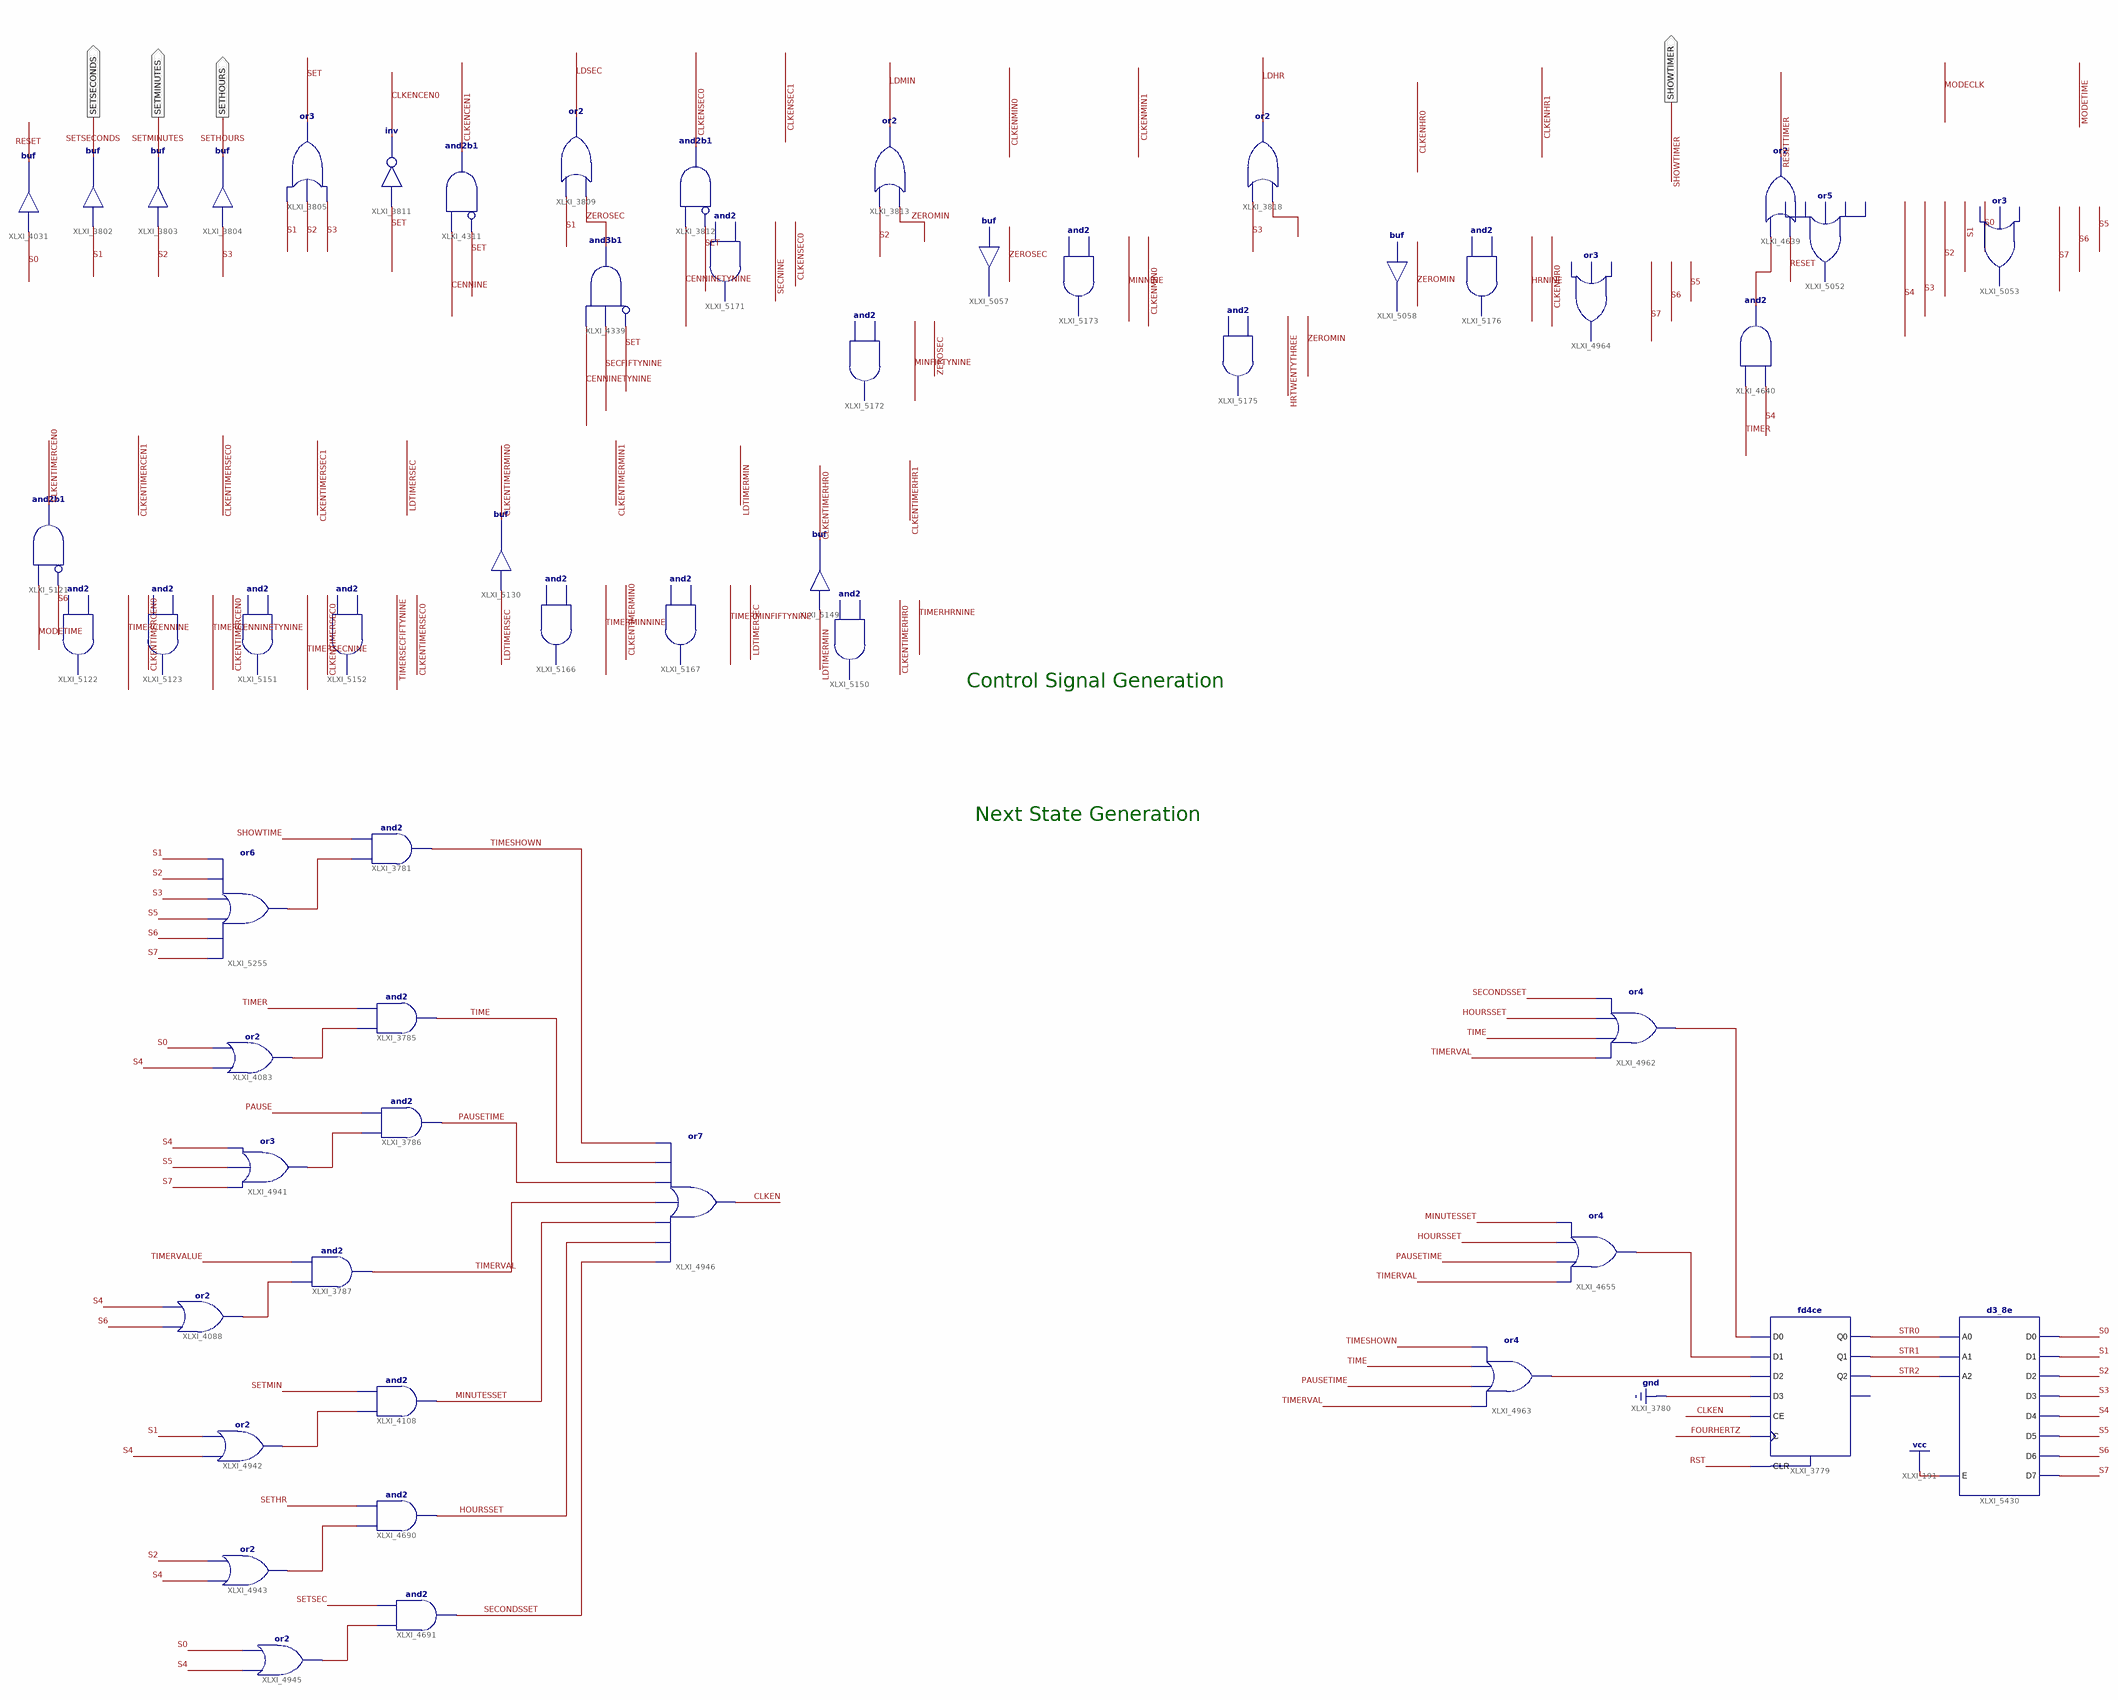
[diagram p0: schematic sheet 1]
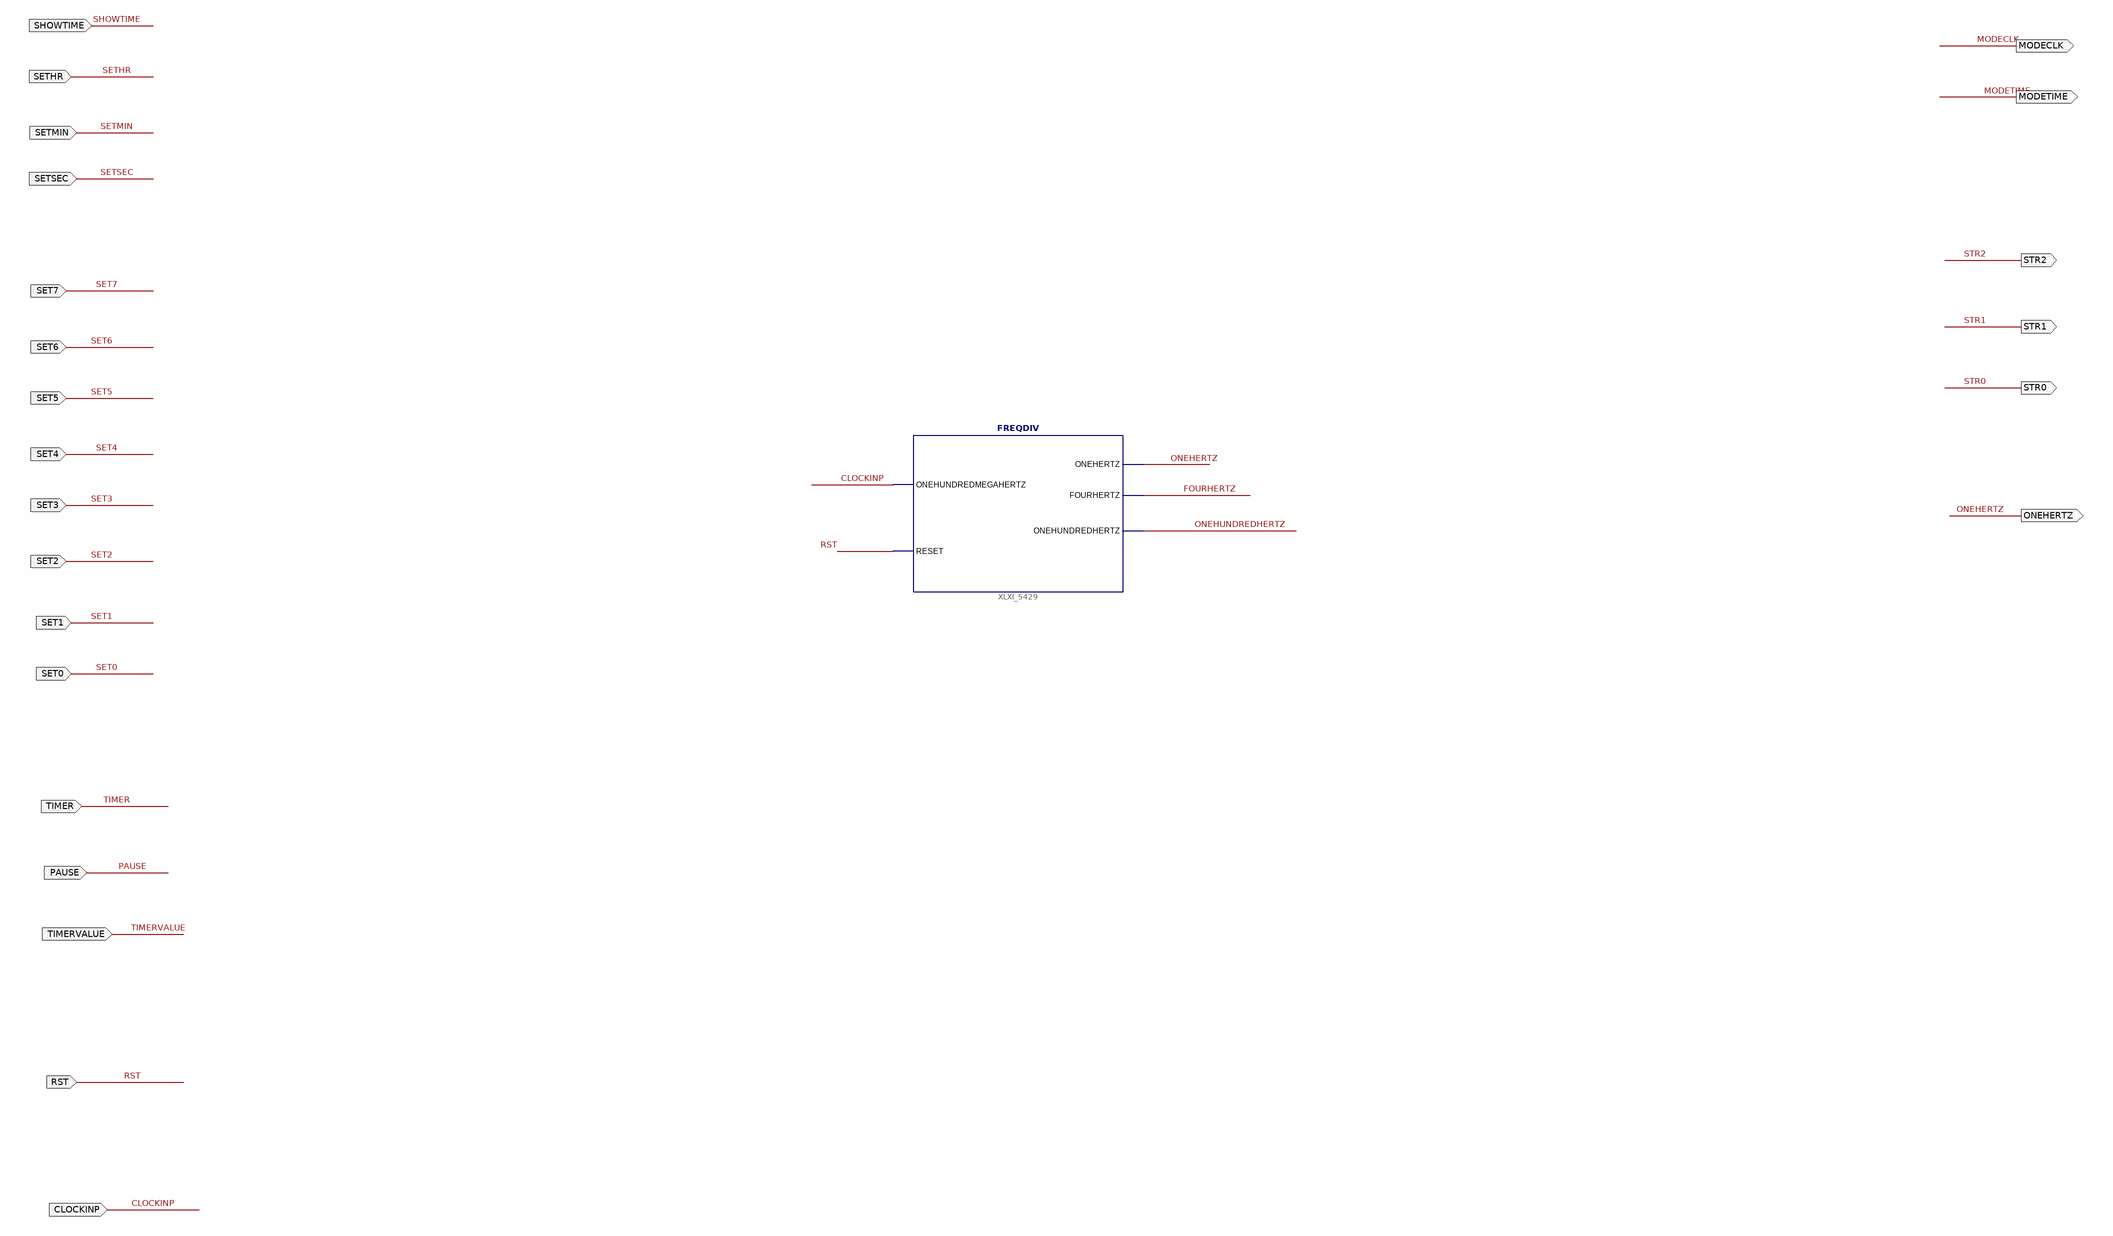
[diagram p1: schematic sheet 2]
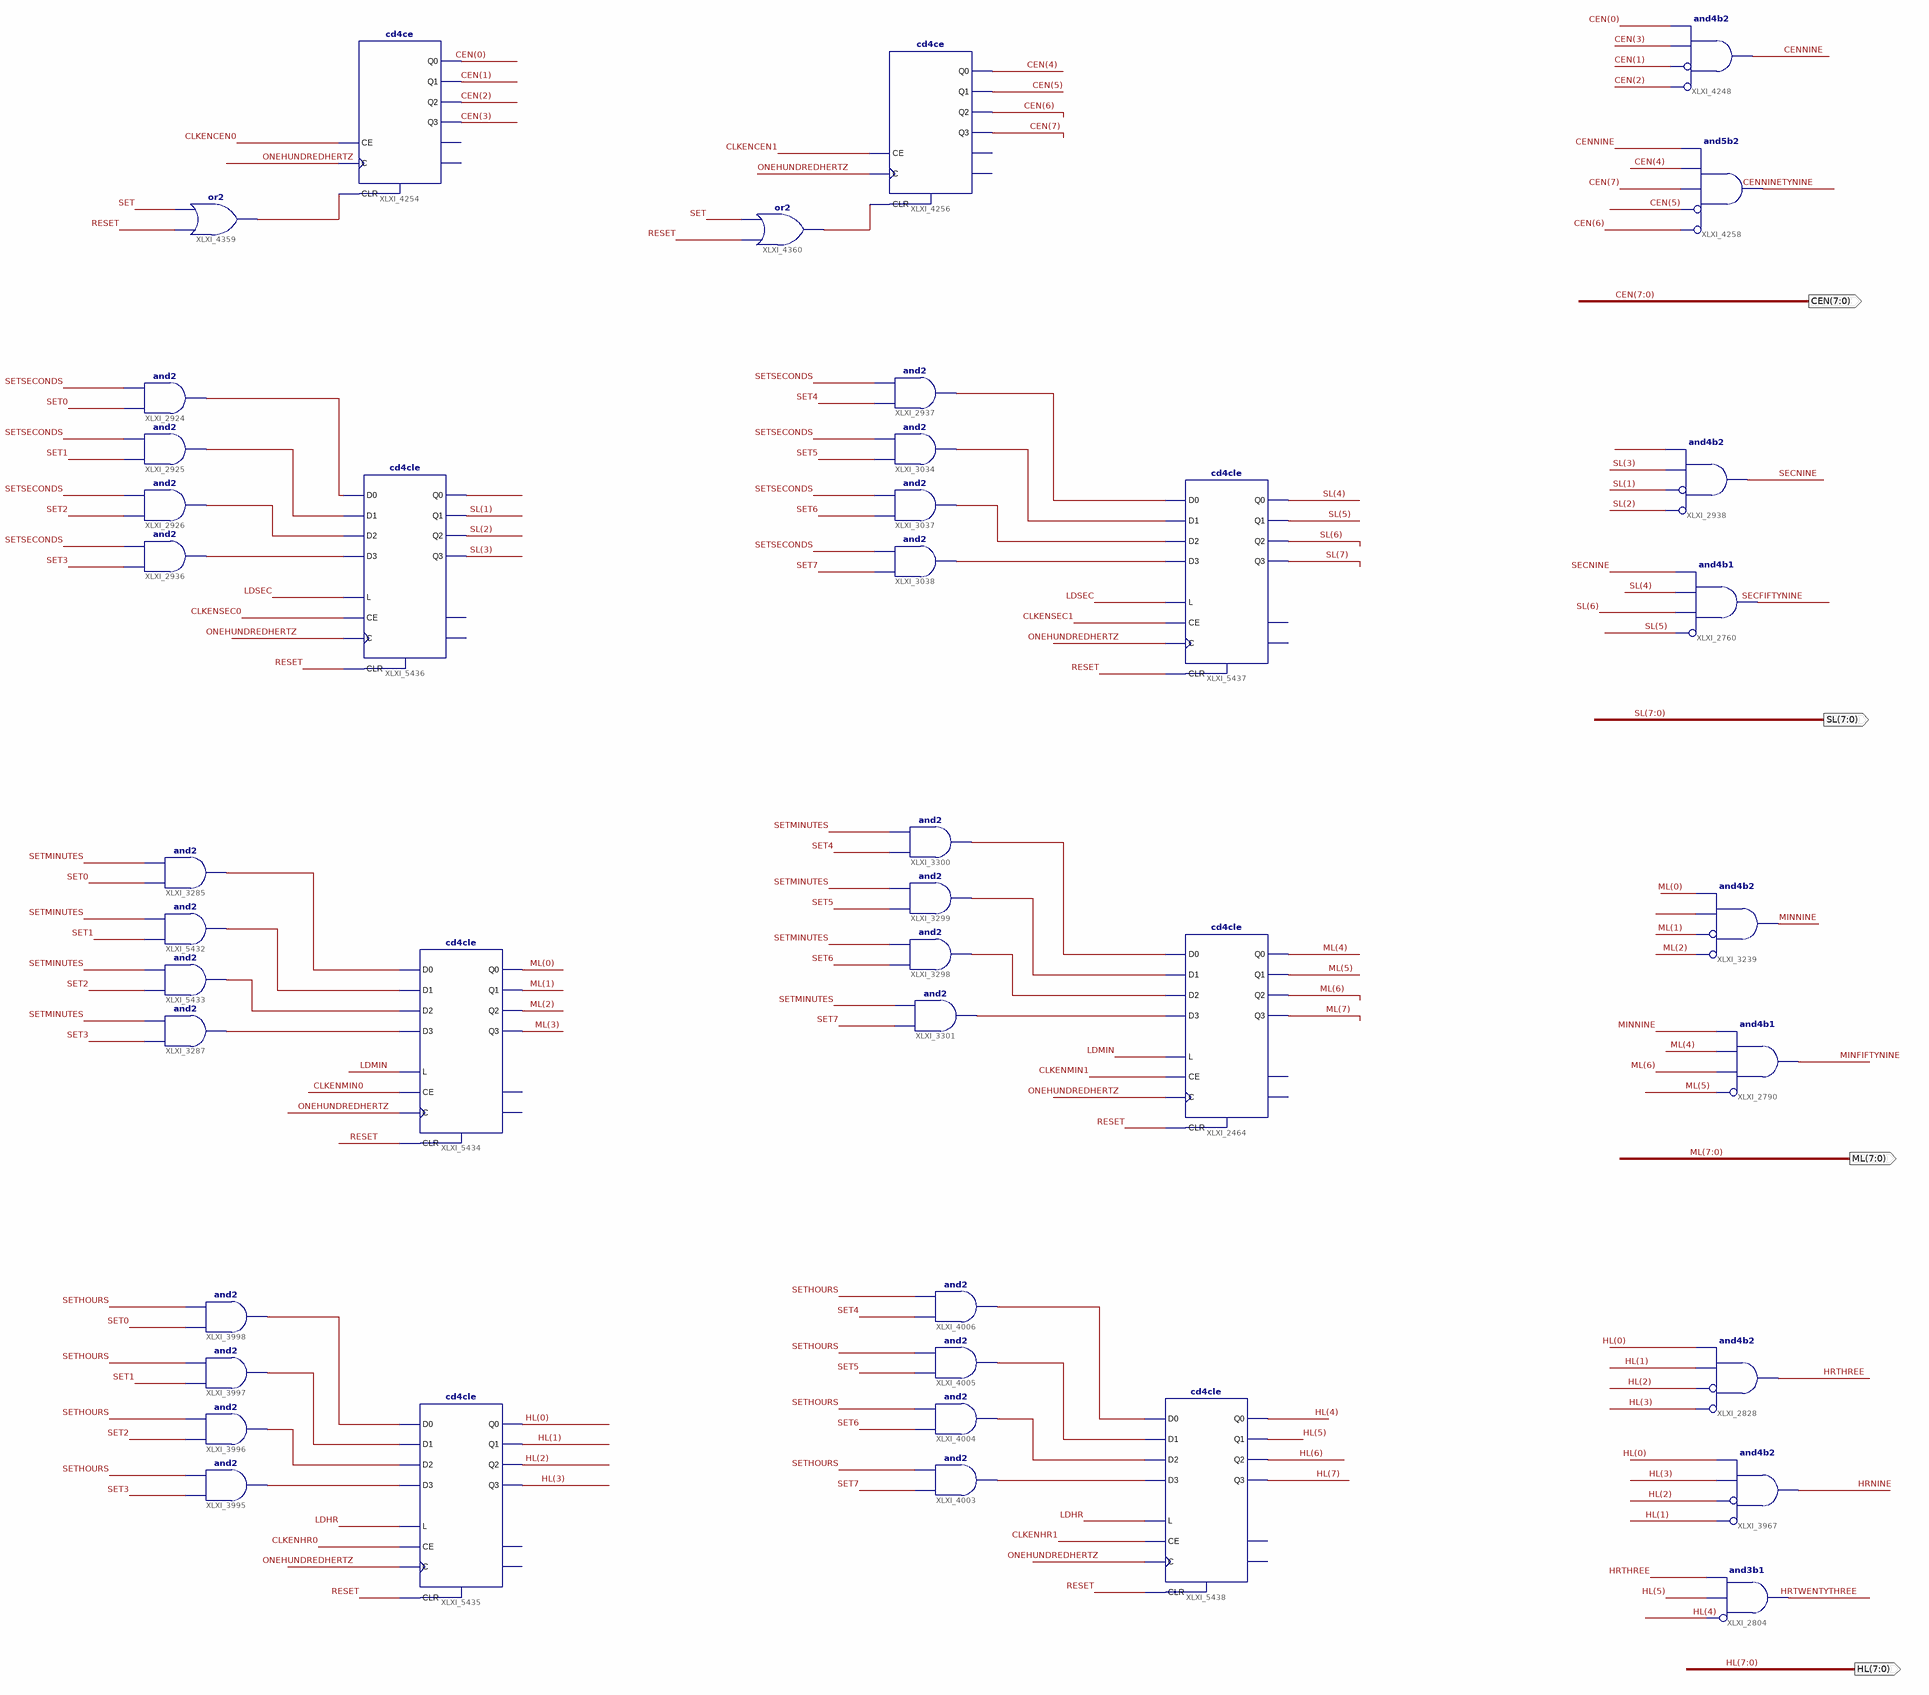
[diagram p2: schematic sheet 3]
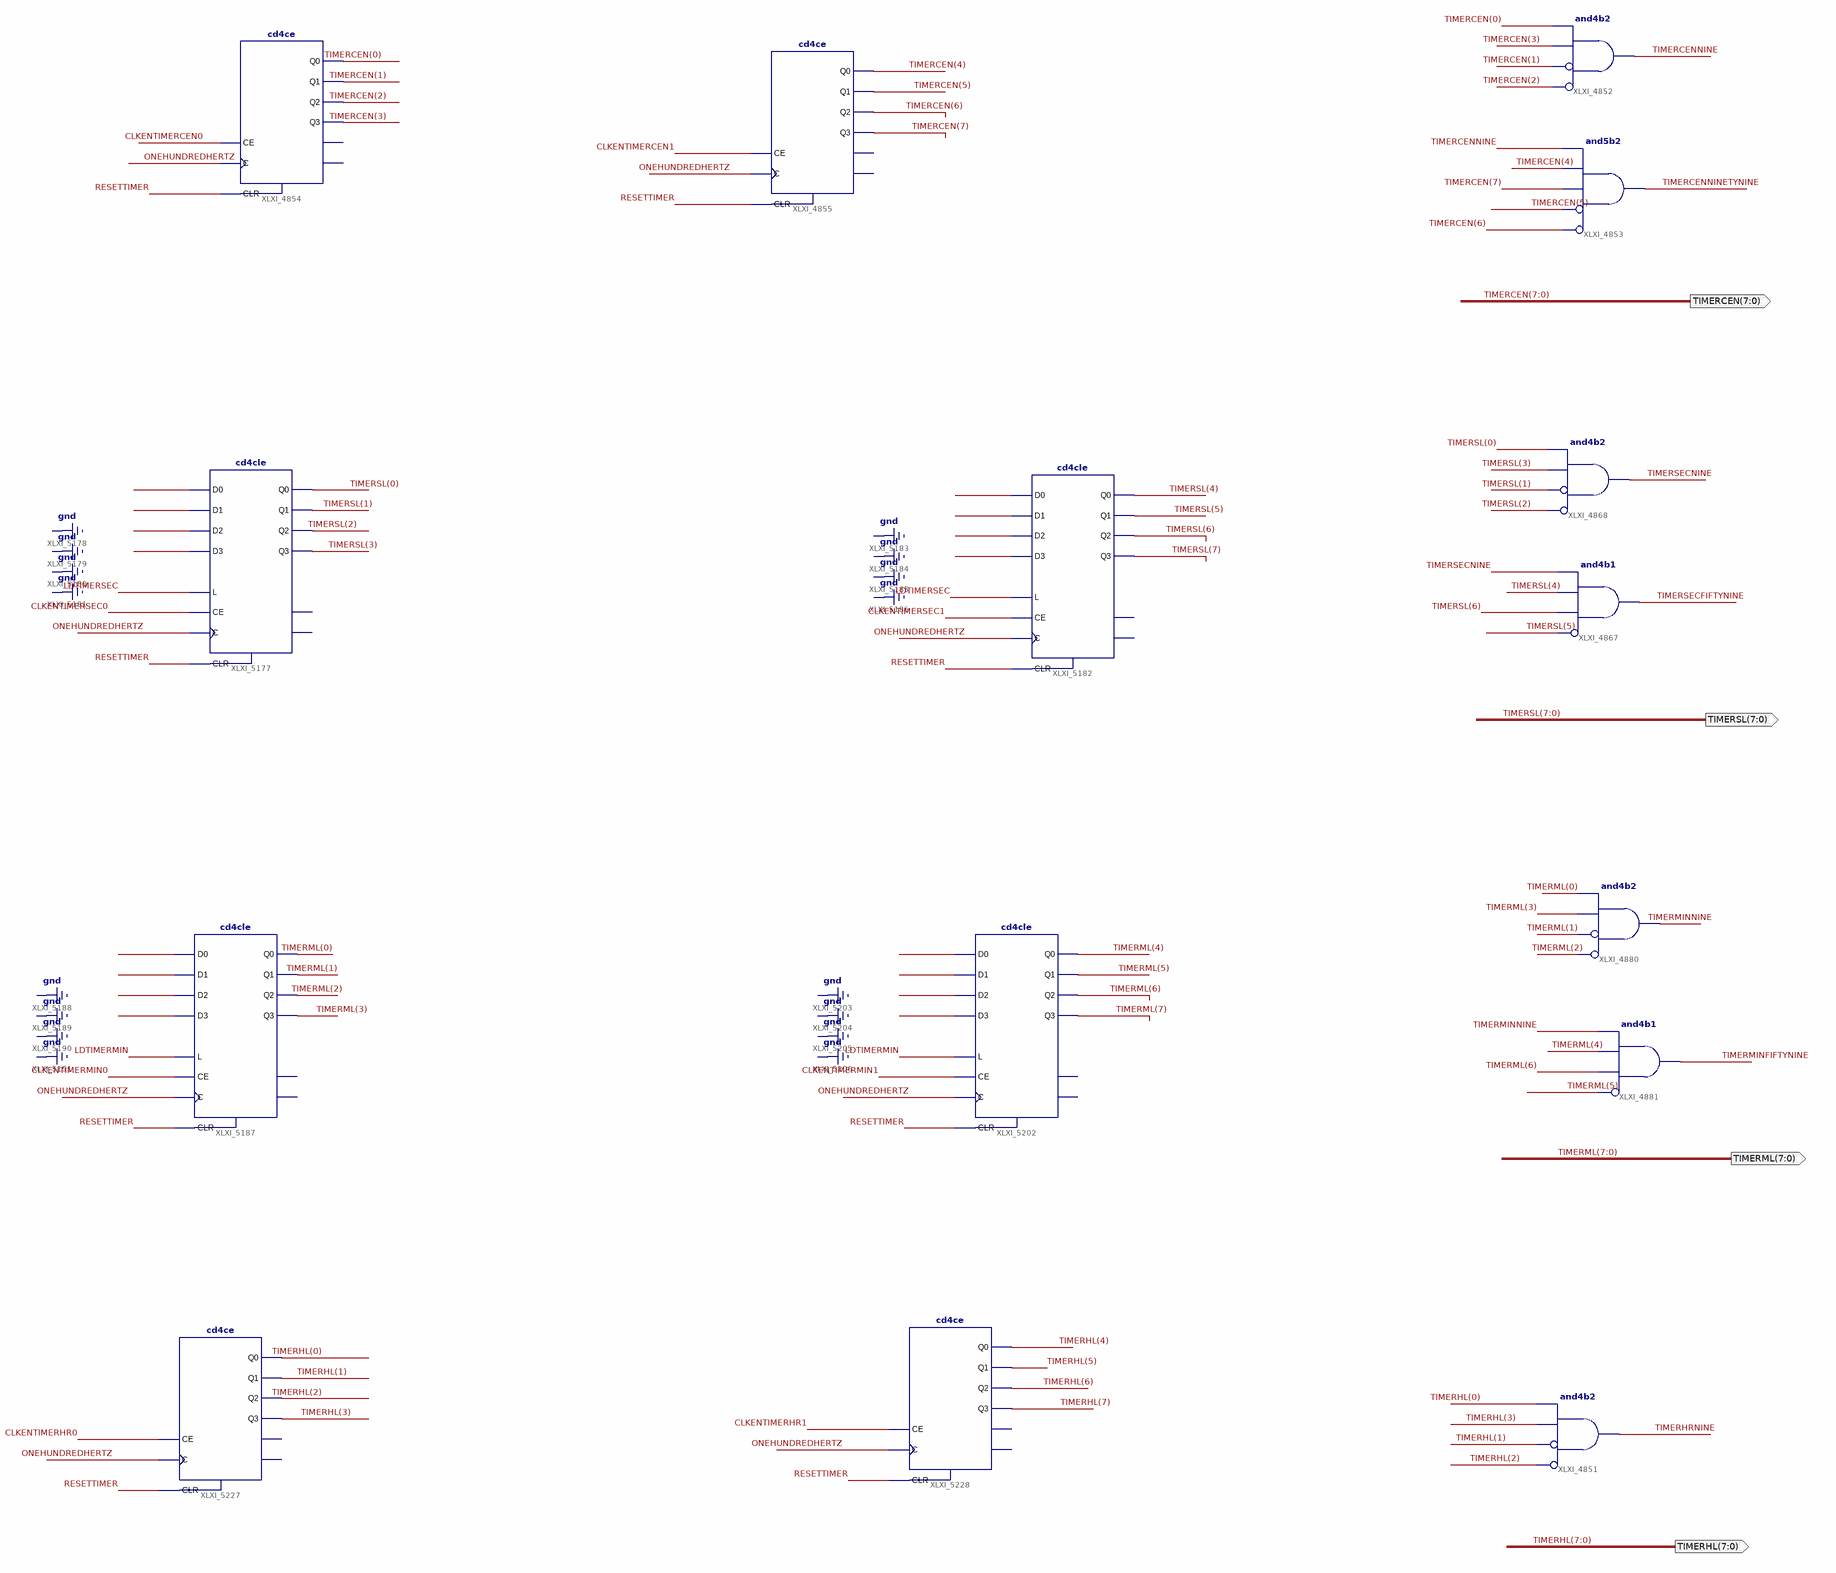
[diagram p3: schematic sheet 4]
// Xilinx ISE schematic clockblock.sch (artix7) as structural Verilog: 113 symbols, 35 ports
module clockblock (
  input  SET0,
  input  SET1,
  input  SET2,
  input  SET3,
  input  SET4,
  input  SET5,
  input  SET6,
  input  SET7,
  input  SETHR,
  input  SETMIN,
  input  SETSEC,
  input  SHOWTIME,
  input  RST,
  input  TIMER,
  input  PAUSE,
  input  TIMERVALUE,
  input  CLOCKINP,
  output ONEHERTZ,
  output SETMINUTES,
  output SETHOURS,
  output SETSECONDS,
  output [7:0] CEN,
  output [7:0] SL,
  output [7:0] ML,
  output [7:0] HL,
  output SHOWTIMER,
  output [7:0] TIMERCEN,
  output [7:0] TIMERSL,
  output [7:0] TIMERML,
  output MODECLK,
  output MODETIME,
  output [7:0] TIMERHL,
  output STR2,
  output STR1,
  output STR0
);

  wire CENNINE, CENNINETYNINE, CLKEN, CLKENCEN0, CLKENCEN1, CLKENHR0, CLKENHR1, CLKENMIN0, CLKENMIN1,
       CLKENSEC0, CLKENSEC1, CLKENTIMERCEN0, CLKENTIMERCEN1, CLKENTIMERHR0, CLKENTIMERHR1, CLKENTIMERMIN0,
       CLKENTIMERMIN1, CLKENTIMERSEC0, CLKENTIMERSEC1, FOURHERTZ, HOURSSET, HRNINE, HRTHREE, HRTWENTYTHREE,
       LDHR, LDMIN, LDSEC, LDTIMERMIN, LDTIMERSEC, MINFIFTYNINE, MINNINE, MINUTESSET, ONEHUNDREDHERTZ,
       PAUSETIME, RESET, RESETTIMER, S0, S1, S2, S3, S4, S5, S6, S7, SECFIFTYNINE, SECNINE, SECONDSSET, SET,
       TIME, TIMERCENNINE, TIMERCENNINETYNINE, TIMERHRNINE, TIMERMINFIFTYNINE, TIMERMINNINE,
       TIMERSECFIFTYNINE, TIMERSECNINE, TIMERVAL, TIMESHOWN, XLXN_13329, XLXN_13330, XLXN_13331, XLXN_13332,
       XLXN_13353, XLXN_13354, XLXN_13355, XLXN_13356, XLXN_13446, XLXN_13447, XLXN_13450, XLXN_13451,
       XLXN_13600, XLXN_13601, XLXN_13602, XLXN_13669, XLXN_13671, XLXN_13672, XLXN_14325, XLXN_15410,
       XLXN_17314, XLXN_17406, XLXN_18079, XLXN_18080, XLXN_18102, XLXN_18105, XLXN_18201, XLXN_18385,
       XLXN_19485, XLXN_19489, XLXN_20635, XLXN_20683, XLXN_21780, XLXN_21821, XLXN_21833, XLXN_21851,
       XLXN_21870, XLXN_21876, ZEROMIN, ZEROSEC;

  and XLXI_3967 (HRNINE, ~HL[1], ~HL[2], HL[3], HL[0]);  // and4b2
  and XLXI_2828 (HRTHREE, ~HL[3], ~HL[2], HL[1], HL[0]);  // and4b2
  and XLXI_4248 (CENNINE, ~CEN[2], ~CEN[1], CEN[3], CEN[0]);  // and4b2
  and XLXI_4258 (CENNINETYNINE, ~CEN[6], ~CEN[5], CEN[7], CEN[4], CENNINE);  // and5b2
  cd4ce XLXI_4254 (
    .C(ONEHUNDREDHERTZ), .CE(CLKENCEN0), .CLR(XLXN_19489), .Q0(CEN[0]), .Q1(CEN[1]), .Q2(CEN[2]), .Q3(CEN[3]));  // open: CEO, TC
  cd4ce XLXI_4256 (
    .C(ONEHUNDREDHERTZ), .CE(CLKENCEN1), .CLR(XLXN_19485), .Q0(CEN[4]), .Q1(CEN[5]), .Q2(CEN[6]), .Q3(CEN[7]));  // open: CEO, TC
  or XLXI_4359 (XLXN_19489, RESET, SET);
  or XLXI_4360 (XLXN_19485, RESET, SET);
  and XLXI_2760 (SECFIFTYNINE, ~SL[5], SL[6], SL[4], SECNINE);  // and4b1
  and XLXI_2938 (SECNINE, ~SL[2], ~SL[1], SL[3], SL[0]);  // and4b2
  and XLXI_3239 (MINNINE, ~ML[2], ~ML[1], ML[3], ML[0]);  // and4b2
  and XLXI_2790 (MINFIFTYNINE, ~ML[5], ML[6], ML[4], MINNINE);  // and4b1
  fd4ce XLXI_3779 (
    .C(FOURHERTZ), .CE(CLKEN), .CLR(RST), .D0(XLXN_18201), .D1(XLXN_17314), .D2(XLXN_20683), .D3(1'b0),
    .Q0(STR0), .Q1(STR1), .Q2(STR2));  // open: Q3
  and XLXI_2804 (HRTWENTYTHREE, ~HL[4], HL[5], HRTHREE);  // and3b1
  or XLXI_4655 (XLXN_17314, TIMERVAL, PAUSETIME, HOURSSET, MINUTESSET);
  and XLXI_4852 (TIMERCENNINE, ~TIMERCEN[2], ~TIMERCEN[1], TIMERCEN[3], TIMERCEN[0]);  // and4b2
  and XLXI_4853 (TIMERCENNINETYNINE, ~TIMERCEN[6], ~TIMERCEN[5], TIMERCEN[7], TIMERCEN[4], TIMERCENNINE);  // and5b2
  cd4ce XLXI_4854 (
    .C(ONEHUNDREDHERTZ), .CE(CLKENTIMERCEN0), .CLR(RESETTIMER), .Q0(TIMERCEN[0]), .Q1(TIMERCEN[1]),
    .Q2(TIMERCEN[2]), .Q3(TIMERCEN[3]));  // open: CEO, TC
  cd4ce XLXI_4855 (
    .C(ONEHUNDREDHERTZ), .CE(CLKENTIMERCEN1), .CLR(RESETTIMER), .Q0(TIMERCEN[4]), .Q1(TIMERCEN[5]),
    .Q2(TIMERCEN[6]), .Q3(TIMERCEN[7]));  // open: CEO, TC
  and XLXI_4867 (TIMERSECFIFTYNINE, ~TIMERSL[5], TIMERSL[6], TIMERSL[4], TIMERSECNINE);  // and4b1
  and XLXI_4868 (TIMERSECNINE, ~TIMERSL[2], ~TIMERSL[1], TIMERSL[3], TIMERSL[0]);  // and4b2
  and XLXI_4880 (TIMERMINNINE, ~TIMERML[2], ~TIMERML[1], TIMERML[3], TIMERML[0]);  // and4b2
  and XLXI_4881 (TIMERMINFIFTYNINE, ~TIMERML[5], TIMERML[6], TIMERML[4], TIMERMINNINE);  // and4b1
  or XLXI_4962 (XLXN_18201, TIMERVAL, TIME, HOURSSET, SECONDSSET);
  or XLXI_4963 (XLXN_20683, TIMERVAL, PAUSETIME, TIME, TIMESHOWN);
  and XLXI_3787 (TIMERVAL, XLXN_21851, TIMERVALUE);
  or XLXI_4088 (XLXN_21851, S6, S4);
  and XLXI_3786 (PAUSETIME, XLXN_21833, PAUSE);
  or XLXI_4941 (XLXN_21833, S4, S5, S7);
  and XLXI_3785 (TIME, XLXN_21821, TIMER);
  or XLXI_4083 (XLXN_21821, S4, S0);
  and XLXI_4691 (SECONDSSET, XLXN_21876, SETSEC);
  or XLXI_4945 (XLXN_21876, S0, S4);
  or XLXI_4946 (CLKEN, TIMESHOWN, TIME, PAUSETIME, TIMERVAL, MINUTESSET, HOURSSET, SECONDSSET);
  or XLXI_4942 (XLXN_18385, S1, S4);
  and XLXI_4108 (MINUTESSET, XLXN_18385, SETMIN);
  and XLXI_4690 (HOURSSET, XLXN_21870, SETHR);
  or XLXI_4943 (XLXN_21870, S2, S4);
  or XLXI_3805 (SET, S3, S2, S1);
  not XLXI_3811 (CLKENCEN0, SET);
  and XLXI_4311 (CLKENCEN1, ~SET, CENNINE);  // and2b1
  or XLXI_3809 (LDSEC, ZEROSEC, S1);
  and XLXI_4339 (ZEROSEC, ~SET, SECFIFTYNINE, CENNINETYNINE);  // and3b1
  and XLXI_3812 (CLKENSEC0, ~SET, CENNINETYNINE);  // and2b1
  or XLXI_3813 (LDMIN, ZEROMIN, S2);
  buf XLXI_5057 (CLKENMIN0, ZEROSEC);
  or XLXI_3818 (LDHR, XLXN_17406, S3);
  buf XLXI_5058 (CLKENHR0, ZEROMIN);
  or XLXI_4639 (RESETTIMER, RESET, XLXN_20635);
  and XLXI_4640 (XLXN_20635, S4, TIMER);
  or XLXI_5053 (MODETIME, S7, S6, S5);
  or XLXI_5052 (MODECLK, S4, S3, S2, S1, S0);
  and XLXI_5121 (CLKENTIMERCEN0, ~S6, MODETIME);  // and2b1
  and XLXI_5122 (CLKENTIMERCEN1, TIMERCENNINE, CLKENTIMERCEN0);
  and XLXI_5123 (CLKENTIMERSEC0, TIMERCENNINETYNINE, CLKENTIMERCEN0);
  and XLXI_5151 (CLKENTIMERSEC1, TIMERSECNINE, CLKENTIMERSEC0);
  and XLXI_5152 (LDTIMERSEC, TIMERSECFIFTYNINE, CLKENTIMERSEC0);
  buf XLXI_5130 (CLKENTIMERMIN0, LDTIMERSEC);
  and XLXI_5166 (CLKENTIMERMIN1, TIMERMINNINE, CLKENTIMERMIN0);
  and XLXI_5167 (LDTIMERMIN, TIMERMINFIFTYNINE, LDTIMERSEC);
  buf XLXI_5149 (CLKENTIMERHR0, LDTIMERMIN);
  and XLXI_5150 (CLKENTIMERHR1, CLKENTIMERHR0, TIMERHRNINE);
  and XLXI_5171 (CLKENSEC1, SECNINE, CLKENSEC0);
  and XLXI_5172 (ZEROMIN, MINFIFTYNINE, ZEROSEC);
  and XLXI_5173 (CLKENMIN1, MINNINE, CLKENMIN0);
  and XLXI_5175 (XLXN_17406, HRTWENTYTHREE, ZEROMIN);
  and XLXI_5176 (CLKENHR1, HRNINE, CLKENHR0);
  cd4cle XLXI_5177 (
    .C(ONEHUNDREDHERTZ), .CE(CLKENTIMERSEC0), .CLR(RESETTIMER), .D0(1'b0), .D1(1'b0), .D2(1'b0), .D3(1'b0),
    .L(LDTIMERSEC), .Q0(TIMERSL[0]), .Q1(TIMERSL[1]), .Q2(TIMERSL[2]), .Q3(TIMERSL[3]));  // open: CEO, TC
  cd4cle XLXI_5182 (
    .C(ONEHUNDREDHERTZ), .CE(CLKENTIMERSEC1), .CLR(RESETTIMER), .D0(1'b0), .D1(1'b0), .D2(1'b0), .D3(1'b0),
    .L(LDTIMERSEC), .Q0(TIMERSL[4]), .Q1(TIMERSL[5]), .Q2(TIMERSL[6]), .Q3(TIMERSL[7]));  // open: CEO, TC
  cd4cle XLXI_5187 (
    .C(ONEHUNDREDHERTZ), .CE(CLKENTIMERMIN0), .CLR(RESETTIMER), .D0(1'b0), .D1(1'b0), .D2(1'b0), .D3(1'b0),
    .L(LDTIMERMIN), .Q0(TIMERML[0]), .Q1(TIMERML[1]), .Q2(TIMERML[2]), .Q3(TIMERML[3]));  // open: CEO, TC
  cd4cle XLXI_5202 (
    .C(ONEHUNDREDHERTZ), .CE(CLKENTIMERMIN1), .CLR(RESETTIMER), .D0(1'b0), .D1(1'b0), .D2(1'b0), .D3(1'b0),
    .L(LDTIMERMIN), .Q0(TIMERML[4]), .Q1(TIMERML[5]), .Q2(TIMERML[6]), .Q3(TIMERML[7]));  // open: CEO, TC
  and XLXI_4851 (TIMERHRNINE, ~TIMERHL[2], ~TIMERHL[1], TIMERHL[3], TIMERHL[0]);  // and4b2
  cd4ce XLXI_5228 (
    .C(ONEHUNDREDHERTZ), .CE(CLKENTIMERHR1), .CLR(RESETTIMER), .Q0(TIMERHL[4]), .Q1(TIMERHL[5]),
    .Q2(TIMERHL[6]), .Q3(TIMERHL[7]));  // open: CEO, TC
  cd4ce XLXI_5227 (
    .C(ONEHUNDREDHERTZ), .CE(CLKENTIMERHR0), .CLR(RESETTIMER), .Q0(TIMERHL[0]), .Q1(TIMERHL[1]),
    .Q2(TIMERHL[2]), .Q3(TIMERHL[3]));  // open: CEO, TC
  and XLXI_3781 (TIMESHOWN, XLXN_21780, SHOWTIME);
  or XLXI_5255 (XLXN_21780, S1, S2, S3, S5, S6, S7);
  d3_8e XLXI_5430 (
    .A0(STR0), .A1(STR1), .A2(STR2), .E(1'b1), .D0(S0), .D1(S1), .D2(S2), .D3(S3), .D4(S4), .D5(S5), .D6(S6),
    .D7(S7));
  buf XLXI_4031 (RESET, S0);
  buf XLXI_3802 (SETSECONDS, S1);
  buf XLXI_3803 (SETMINUTES, S2);
  buf XLXI_3804 (SETHOURS, S3);
  or XLXI_4964 (SHOWTIMER, S7, S6, S5);
  FREQDIV XLXI_5429 (
    .ONEHUNDREDMEGAHERTZ(CLOCKINP), .RESET(RST), .ONEHERTZ(ONEHERTZ), .ONEHUNDREDHERTZ(ONEHUNDREDHERTZ),
    .FOURHERTZ(FOURHERTZ));
  and XLXI_3995 (XLXN_13446, SET3, SETHOURS);
  and XLXI_3996 (XLXN_18079, SET2, SETHOURS);
  and XLXI_3997 (XLXN_18080, SET1, SETHOURS);
  and XLXI_3998 (XLXN_13451, SET0, SETHOURS);
  and XLXI_4003 (XLXN_13450, SET7, SETHOURS);
  and XLXI_4004 (XLXN_18102, SET6, SETHOURS);
  and XLXI_4005 (XLXN_18105, SET5, SETHOURS);
  and XLXI_4006 (XLXN_13447, SET4, SETHOURS);
  and XLXI_2936 (XLXN_14325, SET3, SETSECONDS);
  and XLXI_2926 (XLXN_13602, SET2, SETSECONDS);
  and XLXI_2925 (XLXN_13601, SET1, SETSECONDS);
  and XLXI_2924 (XLXN_13600, SET0, SETSECONDS);
  and XLXI_3038 (XLXN_13332, SET7, SETSECONDS);
  and XLXI_3037 (XLXN_13331, SET6, SETSECONDS);
  and XLXI_3034 (XLXN_13330, SET5, SETSECONDS);
  and XLXI_2937 (XLXN_13329, SET4, SETSECONDS);
  and XLXI_3287 (XLXN_13669, SET3, SETMINUTES);
  and XLXI_3285 (XLXN_13672, SET0, SETMINUTES);
  cd4cle XLXI_2464 (
    .C(ONEHUNDREDHERTZ), .CE(CLKENMIN1), .CLR(RESET), .D0(XLXN_13353), .D1(XLXN_13354), .D2(XLXN_13355),
    .D3(XLXN_13356), .L(LDMIN), .Q0(ML[4]), .Q1(ML[5]), .Q2(ML[6]), .Q3(ML[7]));  // open: CEO, TC
  and XLXI_3301 (XLXN_13356, SET7, SETMINUTES);
  and XLXI_3298 (XLXN_13355, SET6, SETMINUTES);
  and XLXI_3299 (XLXN_13354, SET5, SETMINUTES);
  and XLXI_3300 (XLXN_13353, SET4, SETMINUTES);
  and XLXI_5432 (XLXN_13671, SET1, SETMINUTES);
  and XLXI_5433 (XLXN_15410, SET2, SETMINUTES);
  cd4cle XLXI_5434 (
    .C(ONEHUNDREDHERTZ), .CE(CLKENMIN0), .CLR(RESET), .D0(XLXN_13672), .D1(XLXN_13671), .D2(XLXN_15410),
    .D3(XLXN_13669), .L(LDMIN), .Q0(ML[0]), .Q1(ML[1]), .Q2(ML[2]), .Q3(ML[3]));  // open: CEO, TC
  cd4cle XLXI_5435 (
    .C(ONEHUNDREDHERTZ), .CE(CLKENHR0), .CLR(RESET), .D0(XLXN_13451), .D1(XLXN_18080), .D2(XLXN_18079),
    .D3(XLXN_13446), .L(LDHR), .Q0(HL[0]), .Q1(HL[1]), .Q2(HL[2]), .Q3(HL[3]));  // open: CEO, TC
  cd4cle XLXI_5436 (
    .C(ONEHUNDREDHERTZ), .CE(CLKENSEC0), .CLR(RESET), .D0(XLXN_13600), .D1(XLXN_13601), .D2(XLXN_13602),
    .D3(XLXN_14325), .L(LDSEC), .Q0(SL[0]), .Q1(SL[1]), .Q2(SL[2]), .Q3(SL[3]));  // open: CEO, TC
  cd4cle XLXI_5437 (
    .C(ONEHUNDREDHERTZ), .CE(CLKENSEC1), .CLR(RESET), .D0(XLXN_13329), .D1(XLXN_13330), .D2(XLXN_13331),
    .D3(XLXN_13332), .L(LDSEC), .Q0(SL[4]), .Q1(SL[5]), .Q2(SL[6]), .Q3(SL[7]));  // open: CEO, TC
  cd4cle XLXI_5438 (
    .C(ONEHUNDREDHERTZ), .CE(CLKENHR1), .CLR(RESET), .D0(XLXN_13447), .D1(XLXN_18105), .D2(XLXN_18102),
    .D3(XLXN_13450), .L(LDHR), .Q0(HL[4]), .Q1(HL[5]), .Q2(HL[6]), .Q3(HL[7]));  // open: CEO, TC

  // Notes on the sheet:
  //   Control Signal Generation
  //   Next State Generation
endmodule
